# EAGLE design RadioPanel (EAGLE 8.3.1)
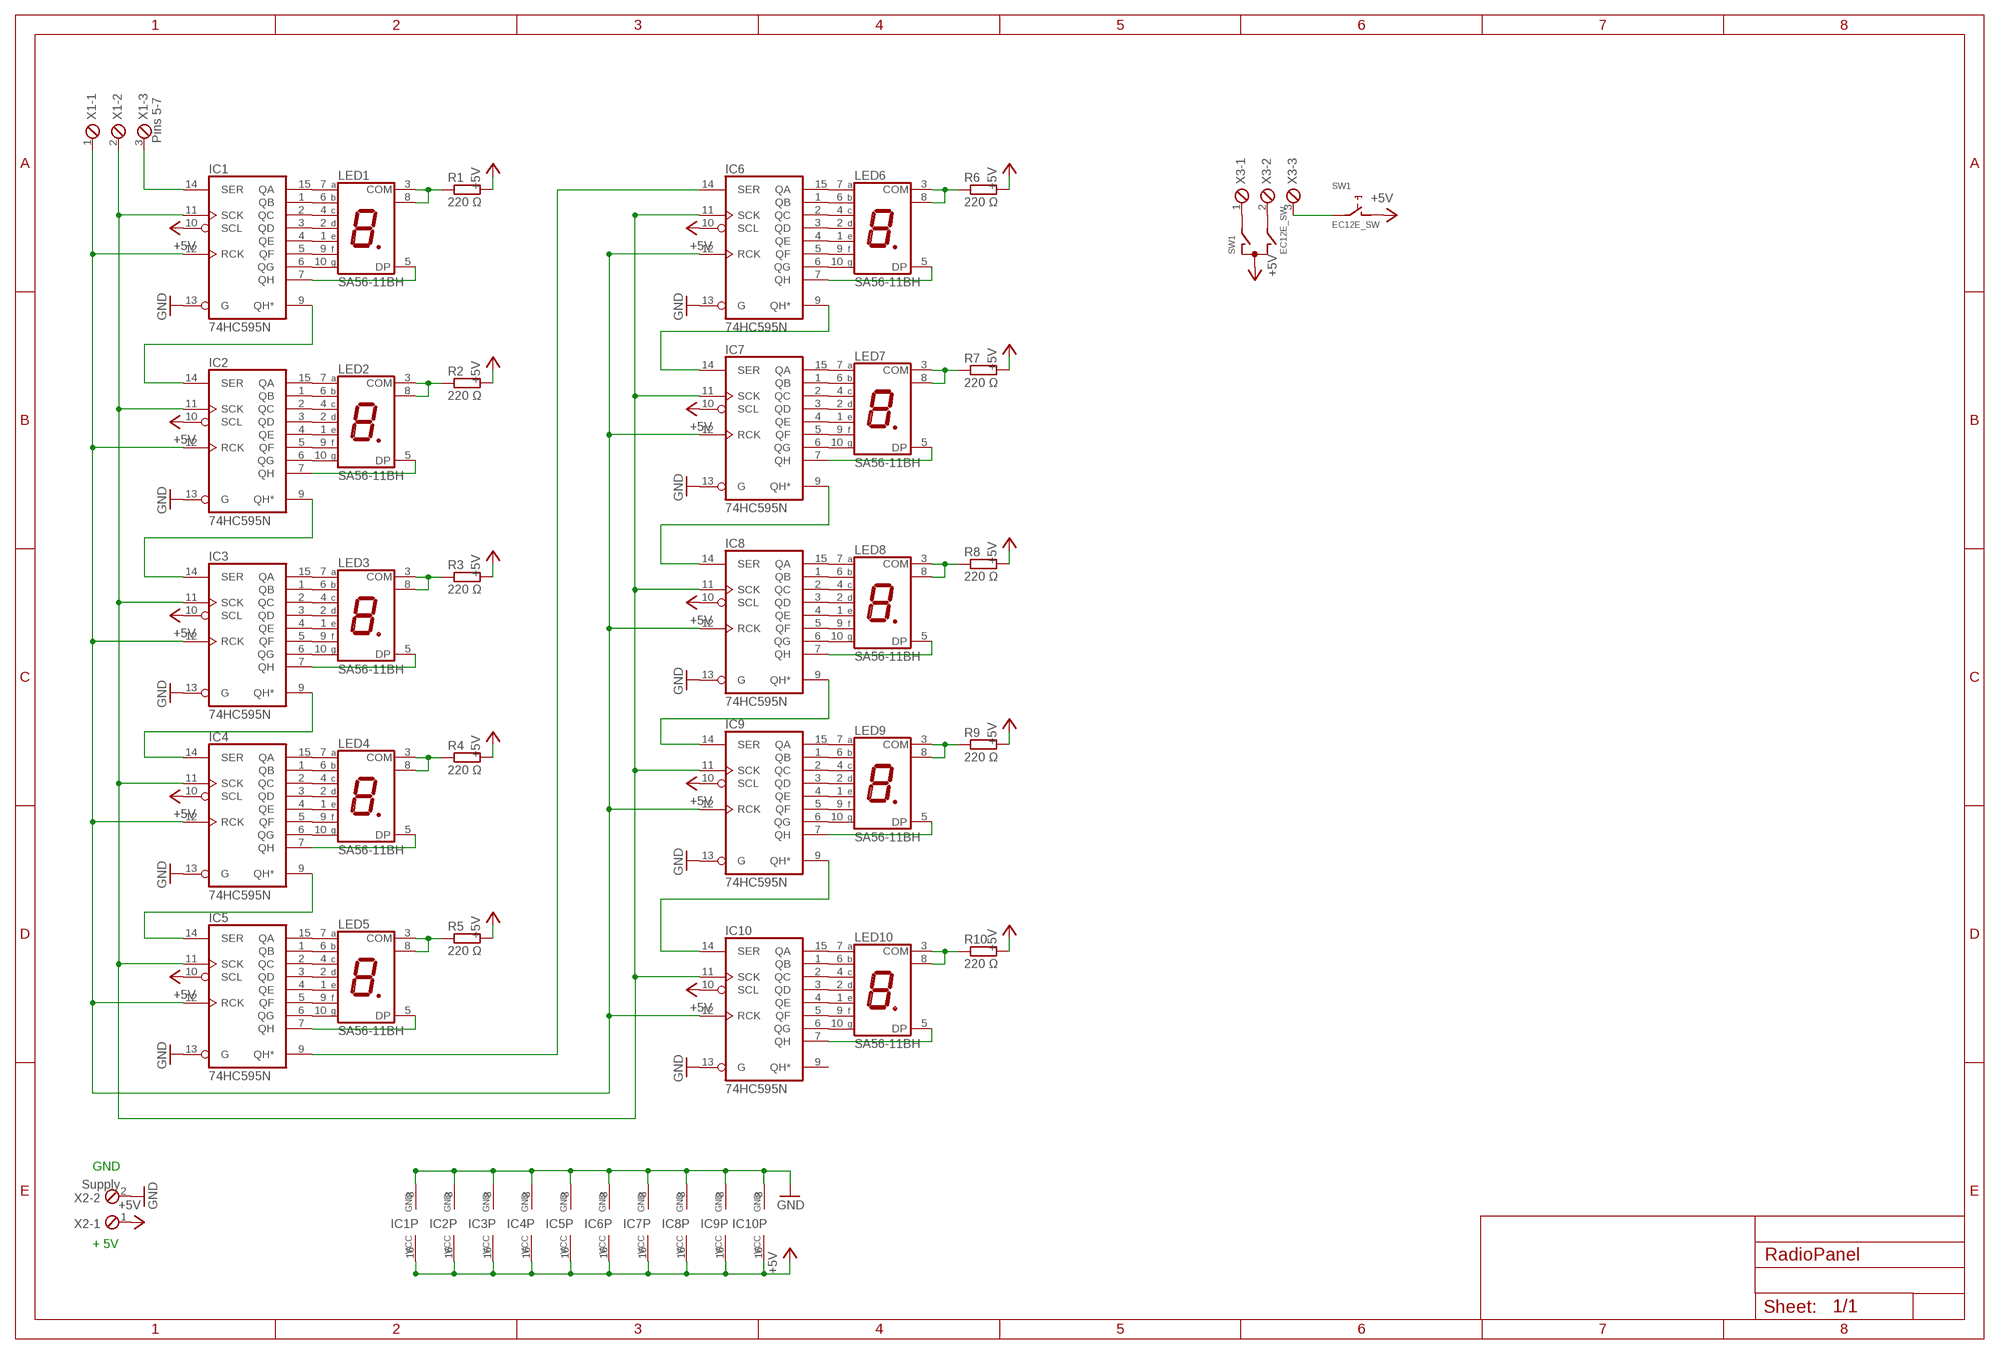
[diagram p0: schematic, sheet 1]

## Parts
IC1  74HC595N  [DIL16]
IC2  74HC595N  [DIL16]
IC3  74HC595N  [DIL16]
IC4  74HC595N  [DIL16]
IC5  74HC595N  [DIL16]
IC6  74HC595N  [DIL16]
IC7  74HC595N  [DIL16]
IC8  74HC595N  [DIL16]
IC9  74HC595N  [DIL16]
IC10  74HC595N  [DIL16]
LED1  SA56-11BH  7-SEG_SA56-11  [SA56-11]
LED2  SA56-11BH  7-SEG_SA56-11  [SA56-11]
LED3  SA56-11BH  7-SEG_SA56-11  [SA56-11]
LED4  SA56-11BH  7-SEG_SA56-11  [SA56-11]
LED5  SA56-11BH  7-SEG_SA56-11  [SA56-11]
LED6  SA56-11BH  7-SEG_SA56-11  [SA56-11]
LED7  SA56-11BH  7-SEG_SA56-11  [SA56-11]
LED8  SA56-11BH  7-SEG_SA56-11  [SA56-11]
LED9  SA56-11BH  7-SEG_SA56-11  [SA56-11]
LED10  SA56-11BH  7-SEG_SA56-11  [SA56-11]
R1  220 Ω  R-EU_0207/12  [0207/12]
R2  220 Ω  R-EU_0207/12  [0207/12]
R3  220 Ω  R-EU_0207/12  [0207/12]
R4  220 Ω  R-EU_0207/12  [0207/12]
R5  220 Ω  R-EU_0207/12  [0207/12]
R6  220 Ω  R-EU_0207/12  [0207/12]
R7  220 Ω  R-EU_0207/12  [0207/12]
R8  220 Ω  R-EU_0207/12  [0207/12]
R9  220 Ω  R-EU_0207/12  [0207/12]
R10  220 Ω  R-EU_0207/12  [0207/12]
SW1  EC12E_SW  [ALPS_EC12E_SW]
X1  Pins 5-7  MPT3  [3POL254]
X2  Supply  MPT2  [2POL254]
X3  MPT3  [3POL254]

## Nets
+5V: IC1.10(SCL) IC1.16(VCC) IC2.10(SCL) IC2.16(VCC) IC3.10(SCL) IC3.16(VCC) IC4.10(SCL) IC4.16(VCC) IC5.10(SCL) IC5.16(VCC) IC6.10(SCL) IC6.16(VCC) IC7.10(SCL) IC7.16(VCC) IC8.10(SCL) IC8.16(VCC) IC9.10(SCL) IC9.16(VCC) IC10.10(SCL) IC10.16(VCC) R1.2 R2.2 R3.2 R4.2 R5.2 R6.2 R7.2 R8.2 R9.2 R10.2 SW1.C SW1.D X2.1
GND: IC1.8(GND) IC1.13(G) IC2.8(GND) IC2.13(G) IC3.8(GND) IC3.13(G) IC4.8(GND) IC4.13(G) IC5.8(GND) IC5.13(G) IC6.8(GND) IC6.13(G) IC7.8(GND) IC7.13(G) IC8.8(GND) IC8.13(G) IC9.8(GND) IC9.13(G) IC10.8(GND) IC10.13(G) X2.2
N$1: IC1.5(QF) LED1.9(F)
N$2: IC1.3(QD) LED1.2(D)
N$3: IC1.1(QB) LED1.6(B)
N$4: IC1.15(QA) LED1.7(A)
N$5: IC1.2(QC) LED1.4(C)
N$6: IC1.4(QE) LED1.1(E)
N$7: IC1.6(QG) LED1.10(G)
N$8: IC2.5(QF) LED2.9(F)
N$9: IC1.7(QH) LED1.5(DP)
N$10: IC2.3(QD) LED2.2(D)
N$11: IC2.1(QB) LED2.6(B)
N$12: IC1.14(SER) X1.3
N$13: IC1.11(SCK) IC2.11(SCK) IC3.11(SCK) IC4.11(SCK) IC5.11(SCK) IC6.11(SCK) IC7.11(SCK) IC8.11(SCK) IC9.11(SCK) IC10.11(SCK) X1.2
N$14: IC1.12(RCK) IC2.12(RCK) IC3.12(RCK) IC4.12(RCK) IC5.12(RCK) IC6.12(RCK) IC7.12(RCK) IC8.12(RCK) IC9.12(RCK) IC10.12(RCK) X1.1
N$15: LED1.3(COM) LED1.8(COM) R1.1
N$16: IC2.15(QA) LED2.7(A)
N$17: IC2.2(QC) LED2.4(C)
N$18: IC2.4(QE) LED2.1(E)
N$19: IC2.6(QG) LED2.10(G)
N$20: IC3.5(QF) LED3.9(F)
N$21: IC3.3(QD) LED3.2(D)
N$22: IC2.7(QH) LED2.5(DP)
N$23: IC1.9(QH*) IC2.14(SER)
N$24: IC3.1(QB) LED3.6(B)
N$25: IC3.15(QA) LED3.7(A)
N$26: LED2.3(COM) LED2.8(COM) R2.1
N$27: IC3.2(QC) LED3.4(C)
N$28: IC3.4(QE) LED3.1(E)
N$29: IC3.6(QG) LED3.10(G)
N$30: IC4.5(QF) LED4.9(F)
N$31: IC4.3(QD) LED4.2(D)
N$32: IC4.1(QB) LED4.6(B)
N$33: IC4.15(QA) LED4.7(A)
N$34: IC4.2(QC) LED4.4(C)
N$35: IC4.4(QE) LED4.1(E)
N$36: IC4.6(QG) LED4.10(G)
N$37: IC5.5(QF) LED5.9(F)
N$38: IC5.3(QD) LED5.2(D)
N$39: IC5.1(QB) LED5.6(B)
N$40: IC5.15(QA) LED5.7(A)
N$41: IC5.2(QC) LED5.4(C)
N$42: IC3.7(QH) LED3.5(DP)
N$43: IC2.9(QH*) IC3.14(SER)
N$44: IC5.4(QE) LED5.1(E)
N$45: IC5.6(QG) LED5.10(G)
N$46: LED3.3(COM) LED3.8(COM) R3.1
N$47: IC6.5(QF) LED6.9(F)
N$48: IC6.3(QD) LED6.2(D)
N$49: IC6.1(QB) LED6.6(B)
N$50: IC6.15(QA) LED6.7(A)
N$51: IC6.2(QC) LED6.4(C)
N$52: IC6.4(QE) LED6.1(E)
N$53: IC6.6(QG) LED6.10(G)
N$54: IC7.5(QF) LED7.9(F)
N$55: IC7.3(QD) LED7.2(D)
N$56: IC7.1(QB) LED7.6(B)
N$57: IC7.15(QA) LED7.7(A)
N$58: IC7.2(QC) LED7.4(C)
N$59: IC7.4(QE) LED7.1(E)
N$60: IC7.6(QG) LED7.10(G)
N$61: IC8.5(QF) LED8.9(F)
N$62: IC4.7(QH) LED4.5(DP)
N$63: IC3.9(QH*) IC4.14(SER)
N$64: IC8.3(QD) LED8.2(D)
N$65: IC8.1(QB) LED8.6(B)
N$66: LED4.3(COM) LED4.8(COM) R4.1
N$67: IC8.15(QA) LED8.7(A)
N$68: IC8.2(QC) LED8.4(C)
N$69: IC8.4(QE) LED8.1(E)
N$70: IC8.6(QG) LED8.10(G)
N$71: IC9.5(QF) LED9.9(F)
N$72: IC9.3(QD) LED9.2(D)
N$73: IC9.1(QB) LED9.6(B)
N$74: IC9.15(QA) LED9.7(A)
N$75: IC9.2(QC) LED9.4(C)
N$76: IC9.4(QE) LED9.1(E)
N$77: IC9.6(QG) LED9.10(G)
N$78: IC10.5(QF) LED10.9(F)
N$79: IC10.3(QD) LED10.2(D)
N$80: IC10.1(QB) LED10.6(B)
N$81: IC10.15(QA) LED10.7(A)
N$82: IC5.7(QH) LED5.5(DP)
N$83: IC4.9(QH*) IC5.14(SER)
N$84: IC10.2(QC) LED10.4(C)
N$85: IC10.4(QE) LED10.1(E)
N$86: LED5.3(COM) LED5.8(COM) R5.1
N$87: IC10.6(QG) LED10.10(G)
N$88: SW1.A X3.1
N$89: SW1.B X3.2
N$90: SW1.E X3.3
N$102: IC6.7(QH) LED6.5(DP)
N$103: IC5.9(QH*) IC6.14(SER)
N$106: LED6.3(COM) LED6.8(COM) R6.1
N$122: IC7.7(QH) LED7.5(DP)
N$123: IC6.9(QH*) IC7.14(SER)
N$126: LED7.3(COM) LED7.8(COM) R7.1
N$142: IC8.7(QH) LED8.5(DP)
N$143: IC7.9(QH*) IC8.14(SER)
N$146: LED8.3(COM) LED8.8(COM) R8.1
N$162: IC9.7(QH) LED9.5(DP)
N$163: IC8.9(QH*) IC9.14(SER)
N$166: LED9.3(COM) LED9.8(COM) R9.1
N$182: IC10.7(QH) LED10.5(DP)
N$183: IC9.9(QH*) IC10.14(SER)
N$186: LED10.3(COM) LED10.8(COM) R10.1
Unconnected: IC10.9(QH*) SW1.GND1(G) SW1.GND2(G)

## Notes on the sheet
- GND
- + 5V

## Library data of the parts
IC1-IC10 = 74xx-eu:74*595: 8-bit SHIFT REGISTER, output latch
LED1-LED10 = display-kingbright:7-SEG_: Kingbright 14.2mm (0.56 INCH) SINGLE DIGIT NUMERIC DUISPLAY Source: SA56-11EWA(Ver1189471036.pdf; OC_FARNELL: unknown; OC_NEWARK: unknown
R1-R10 = resistor:R-EU_: RESISTOR, European symbol
SW1 = switch-alps:EC12E_SW: ALPS rotary Encoder EC12E series with switch; MPN: EC12E2424407; OC_FARNELL: 1520813; OC_NEWARK: 74M1068
X1 X3 = con-phoenix-254:MPT3: PHOENIX CONNECTOR; OC_FARNELL: unknown; OC_NEWARK: unknown
X2 = con-phoenix-254:MPT2: PHOENIX CONNECTOR; OC_FARNELL: unknown; OC_NEWARK: unknown

## Board
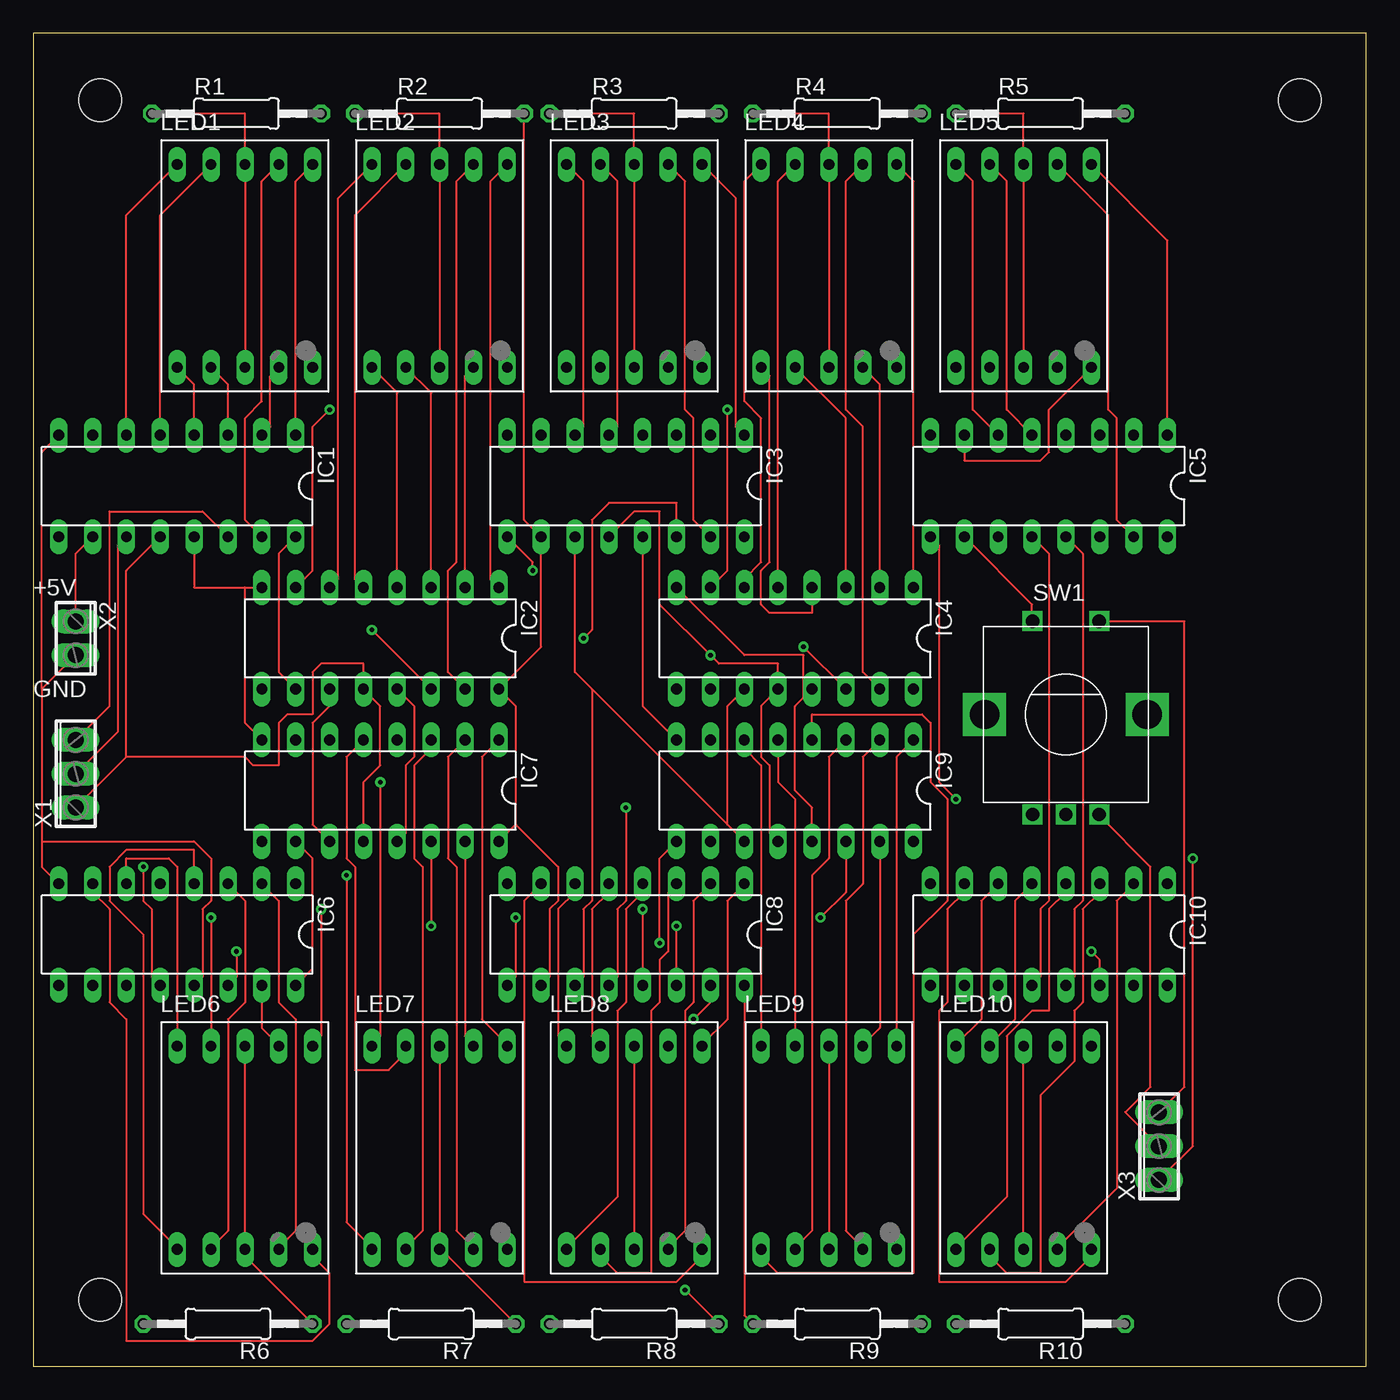
[diagram p1: board, top side]
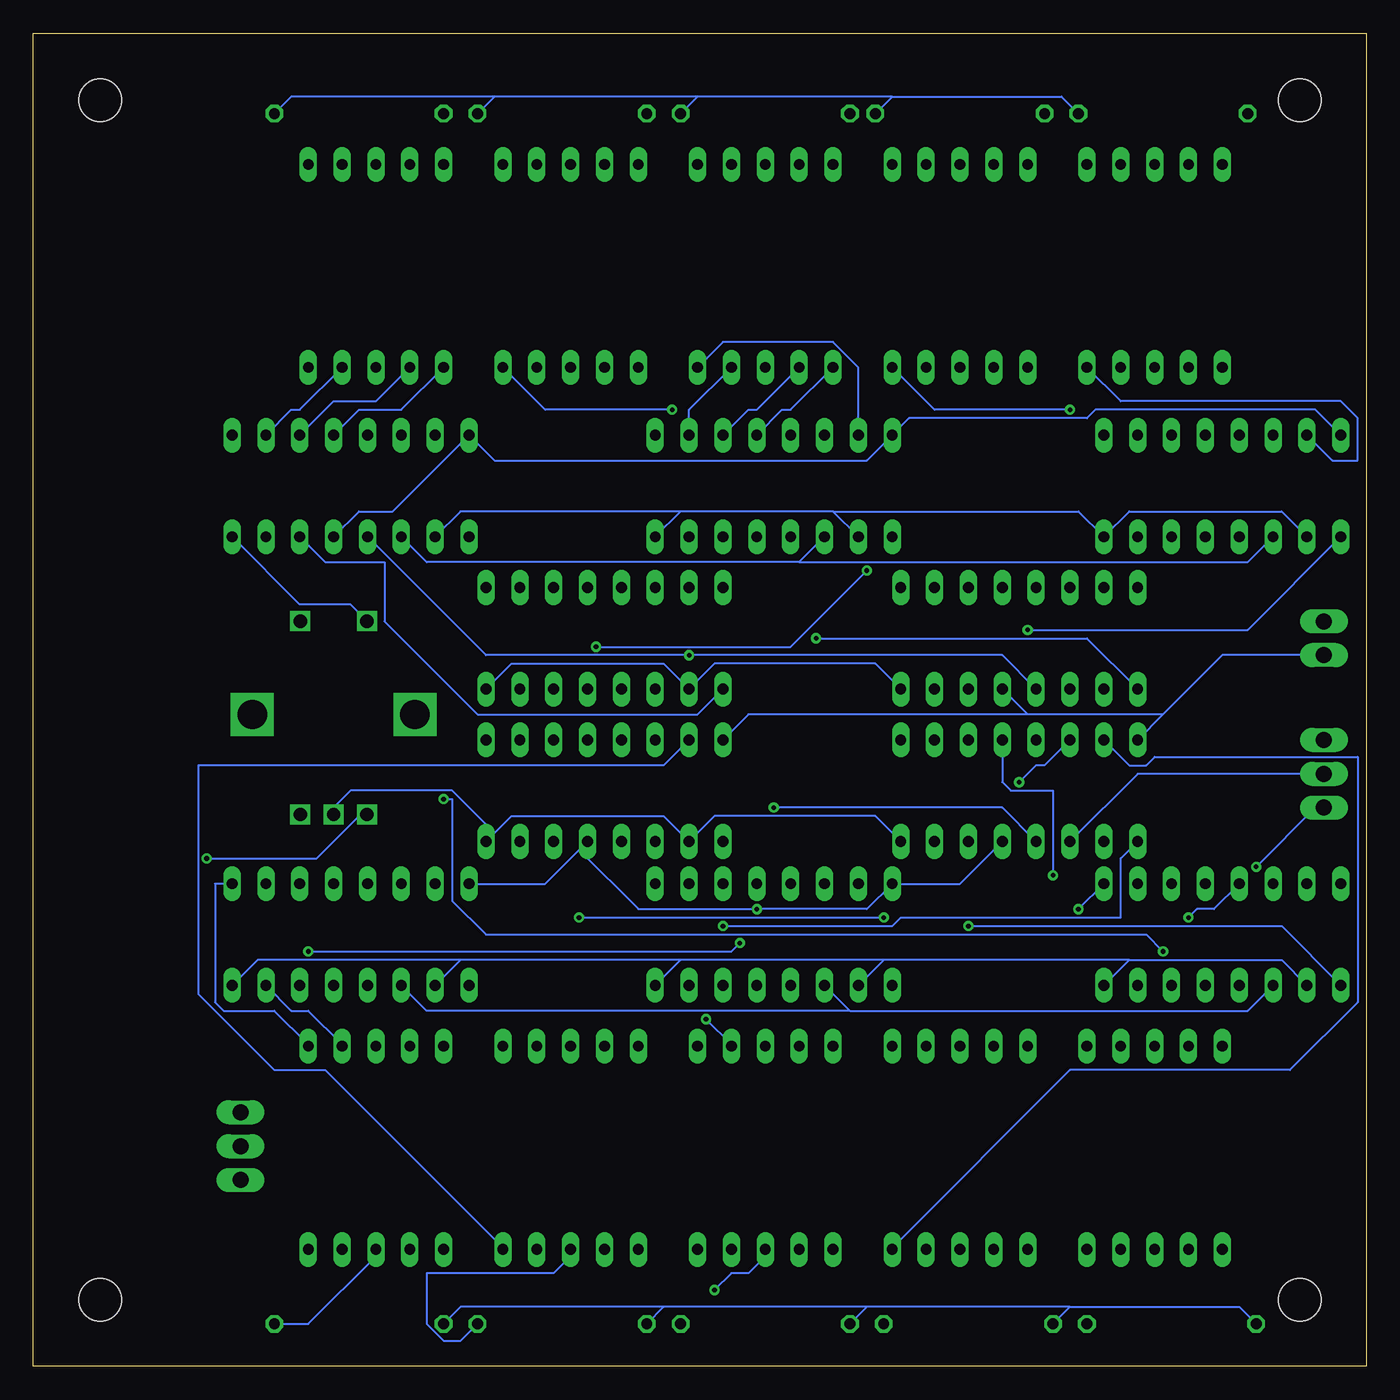
[diagram p2: board, bottom side, seen from below]

Size 100 x 100 mm. Coordinates in mm from the lower left corner, seen from the top.
Outline: 0,0 100,0 100,100 0,100 0,0
Copper layers (1*16): Top 0.035mm / dielectric 1.5mm / Bottom 0.035mm
Design rules "default *": minimum track width 6mil, minimum drill 0.35mm, track to track 6mil, track to pad 6mil, pad to pad 6mil, via to via 6mil, smd to smd 6mil, copper to edge 6mil, drill to drill 6mil, minimum pad ring 10mil, minimum via ring 8mil, stop-mask expansion 4mil, vias tented up to drill 0mil, thermal gap 10mil
Holes 3.2 mm at 5,95 95,95 95,5 5,5

### Footprints (pad centres in the part's own frame; a part is rotated, then mirrored left to right if it is on the bottom)
DIL16 = drill 0.813 long: 1 -8.89,-3.81; 2 -6.35,-3.81; 3 -3.81,-3.81; 4 -1.27,-3.81; 5 1.27,-3.81; 6 3.81,-3.81; 7 6.35,-3.81; 8 8.89,-3.81; 9 8.89,3.81; 10 6.35,3.81; 11 3.81,3.81; 12 1.27,3.81; 13 -1.27,3.81; 14 -3.81,3.81; 15 -6.35,3.81; 16 -8.89,3.81
SA56-11 = drill 0.8 long: 1 -5.08,-7.62; 2 -2.54,-7.62; 3 0,-7.62; 4 2.54,-7.62; 5 5.08,-7.62; 6 5.08,7.62; 7 2.54,7.62; 8 0,7.62; 9 -2.54,7.62; 10 -5.08,7.62
0207/12 = drill 0.813 octagon: 1 -6.35,0; 2 6.35,0
ALPS_EC12E_SW = drill 1 square: A -2.5,-7.5; B 2.5,-7.5; C 0,-7.5; D -2.5,7; E 2.5,7 | drill 2.2 square: GND1 -6.1,0; GND2 6.1,0
3POL254 = drill 1.2 long: 1 -2.54,0; 2 0,0; 3 2.54,0
2POL254 = drill 1.2 long: 1 -1.27,0; 2 1.27,0

### Placement (x,y rotation side)
IC1  10.79,66.04 180 top
IC2  26.04,54.61 180 top
IC3  44.45,66.04 180 top
IC4  57.15,54.61 180 top
IC5  76.2,66.04 180 top
IC6  10.79,32.38 180 top
IC7  26.04,43.18 180 top
IC8  44.45,32.38 180 top
IC9  57.15,43.18 180 top
IC10  76.2,32.38 180 top
LED1  15.88,82.55 0 top
LED2  30.48,82.55 0 top
LED3  45.09,82.55 0 top
LED4  59.69,82.55 0 top
LED5  74.3,82.55 0 top
LED6  15.88,16.38 0 top
LED7  30.48,16.38 0 top
LED8  45.09,16.38 0 top
LED9  59.69,16.38 0 top
LED10  74.3,16.38 0 top
R1  15.24,93.98 0 top
R2  30.48,93.98 0 top
R3  45.09,93.98 0 top
R4  60.33,93.98 0 top
R5  75.56,93.98 0 top
R6  14.61,3.17 180 top
R7  29.84,3.17 180 top
R8  45.09,3.17 180 top
R9  60.33,3.17 180 top
R10  75.56,3.17 180 top
SW1  77.47,48.9 0 top
X1  3.17,44.45 90 top
X2  3.17,54.61 270 top
X3  84.45,16.51 90 top

### Tracks (layer width: path | path; a pad name or v marks a point on that pad's centre or on a via)
+5V
  Top 0.152: IC7.10 20.95,38.1 20.95,29.84 IC6.16 | R9.2 53.34,3.81 IC8.16 | IC1.10 3.17,60.96 X2.1 | IC2.10 18.41,52.07 18.41,60.96 IC1.16 | IC5.10 74.93,57.15 74.93,56.52 SW1.D | 36.2,40.64 IC7.16 | 36.2,40.64 36.2,49.53 IC2.16 38.1,53.98 IC3.10 36.83,63.5 R2.2 | IC8.10 38.73,29.21 38.73,34.29 39.37,34.92 39.37,37.47 36.2,40.64
  Bottom 0.152: R6.2 9.53,4.45 22.23,4.45 | R7.2 22.23,4.45 | 37.47,4.45 R8.2 | 22.23,4.45 37.47,4.45 | 52.7,4.45 R9.2 | 37.47,4.45 52.7,4.45 | R10.2 67.94,4.45 52.7,4.45 | IC6.10 6.35,30.48 17.78,30.48 | IC6.16 17.78,30.48 | 36.2,30.48 IC8.10 | 17.78,30.48 36.2,30.48 | 51.44,30.48 IC8.16 | 36.2,30.48 51.44,30.48 | 67.94,30.48 IC10.10 | 51.44,30.48 67.94,30.48 | IC10.16 83.19,30.48 67.94,30.48 | R1.2 22.86,95.25 35.56,95.25 | R2.2 35.56,95.25 | 50.16,95.25 R3.2 | 35.56,95.25 50.16,95.25 | 65.41,95.25 R4.2 | 50.16,95.25 65.41,95.25 | R5.2 80.64,95.25 65.41,95.25 | 65.41,40.01 64.14,41.27 52.7,41.27 IC9.10 48.9,41.27 36.83,41.27 IC7.16 | 65.41,40.01 68.58,43.18 76.2,43.18 77.47,41.91 SW1.C | 65.41,40.01 IC9.16 | IC1.10 6.35,64.14 17.78,64.14 IC1.16 21.59,64.14 40.01,64.14 | IC5.16 80.01,57.15 76.2,57.15 75.56,56.52 SW1.D | IC4.16 64.14,52.7 52.7,52.7 IC4.10 48.9,52.7 36.83,52.7 IC2.16 | 51.44,64.14 IC3.16 | 40.01,64.14 51.44,64.14 | IC3.10 40.01,64.14 | IC5.10 67.94,64.14 51.44,64.14
GND  (via drill 0.35)
  Top 0.152: IC10.13 78.11,29.21 78.11,34.29 78.74,34.92 78.74,60.96 IC5.13 | v45.72,34.29 IC8.13 | 57.78,50.16 57.15,49.53 57.15,43.18 58.42,41.91 IC9.13 | IC4.8 53.34,53.34 57.78,53.34 57.78,50.16 | 57.78,50.16 IC4.13 | IC9.8 45.72,49.53 IC3.13 | 15.88,58.42 12.06,58.42 IC1.13 | 15.88,58.42 IC2.8 | IC6.8 0.64,37.47 0.64,39.37 | 0.64,50.8 0.64,39.37 | X2.2 0.64,50.8 | IC6.13 12.7,29.21 12.7,34.29 13.34,34.92 13.34,38.1 12.06,39.37 0.64,39.37 | IC1.8 0.64,68.58 0.64,50.8 | 15.88,58.42 15.88,48.26 IC7.8 | IC7.13 27.94,40.01 27.94,45.09 28.57,45.72 28.57,49.53 IC2.13
  Bottom 0.152: IC5.13 75.56,64.14 73.03,64.14 IC5.8 65.41,67.94 37.47,67.94 IC3.8 34.29,71.12 20.95,71.12 20.32,71.75 3.81,71.75 IC1.8 | IC7.13 30.48,36.2 IC8.8 37.47,34.29 v45.72,34.29 54.61,34.29 59.05,38.73 | 59.05,38.73 61.59,36.2 IC10.8 | 59.05,38.73 IC9.13 | 15.24,48.9 10.79,53.34 X2.2 | 15.24,48.9 IC7.8 | 25.4,48.9 IC2.13 | 15.24,48.9 25.4,48.9 | IC9.8 46.35,48.9 25.4,48.9
N$1
  Top 0.152: LED1.9 9.53,86.36 IC1.5
N$2
  Top 0.152: LED1.2 14.61,73.66 IC1.3
N$3
  Top 0.152: LED1.6 19.68,88.9 IC1.1
N$4
  Top 0.152: LED1.7 17.14,88.9 17.14,72.39 15.88,71.12 15.88,63.5 IC1.15
N$5
  Top 0.152: LED1.4 17.78,74.3 17.78,70.48 IC1.2
N$6
  Top 0.152: LED1.1 12.06,73.66 IC1.4
N$7
  Top 0.152: LED1.10 6.99,86.36 IC1.6
N$8
  Top 0.152: LED2.9 24.13,86.36 24.13,59.05 IC2.5
N$9
  Bottom 0.152: LED1.5 18.41,72.39 1.91,72.39 0.64,71.12 0.64,67.94 2.54,67.94 IC1.7
N$10
  Top 0.152: LED2.2 29.84,73.03 IC2.3
N$11
  Top 0.152: LED2.6 34.29,88.9 34.29,59.05 IC2.1
N$12
  Top 0.152: IC1.14 12.7,64.14 5.71,64.14 5.71,49.53 X1.3
N$13
  Top 0.152: IC7.11 20.95,40.64 20.95,48.26 22.23,49.53 IC2.11 | IC1.11 6.35,61.59 6.35,47.62 X1.2 | IC3.11 40.64,52.07 41.91,50.8 | IC9.11 52.07,40.64 | 52.07,40.64 41.91,50.8 | IC4.11 52.07,49.53 52.07,40.64 | IC8.11 41.27,29.21 41.27,34.29 41.91,34.92 41.91,50.8
  Bottom 0.152: IC6.11 8.89,26.67 38.73,26.67 | IC8.11 38.73,26.67 | IC10.11 70.48,26.67 38.73,26.67 | IC7.11 17.14,44.45 X1.2 | IC5.11 70.48,60.33 42.55,60.33 | IC3.11 42.55,60.33 | IC1.11 8.89,60.33 42.55,60.33
N$14  (via drill 0.35)
  Top 0.152: IC6.12 8.89,29.21 8.89,34.29 8.26,34.92 v8.26,37.47 | IC1.12 6.99,59.69 6.99,45.72 | X1.1 6.99,45.72 | IC9.12 55.24,40.01 55.24,45.09 54.61,45.72 54.61,49.53 IC4.12 55.88,52.7 51.44,52.7 v50.8,53.34 46.99,57.15 46.99,64.14 45.09,64.14 IC3.12 | IC10.12 75.56,29.21 75.56,34.29 76.2,34.92 76.2,60.96 IC5.12 | IC8.12 43.81,29.21 43.81,34.29 44.45,34.92 v44.45,41.91 | IC7.12 24.77,43.81 26.04,45.09 26.04,49.53 IC2.12 24.77,52.7 21.59,52.7 20.95,52.07 20.95,48.9 19.05,48.9 18.41,48.26 18.41,45.09 16.51,45.09 15.88,45.72 6.99,45.72
  Bottom 0.152: v8.26,37.47 3.81,41.91 X1.1 | v44.45,41.91 27.3,41.91 IC7.12 | IC5.12 66.04,53.34 v50.8,53.34 27.3,53.34 IC2.12
N$15
  Top 0.152: LED1.3 LED1.8 15.88,93.98 R1.1
N$16
  Top 0.152: LED2.7 31.75,88.9 31.75,60.33 31.11,59.69 31.11,52.07 IC2.15
N$17
  Top 0.152: LED2.4 32.38,74.3 IC2.2
N$18
  Top 0.152: LED2.1 27.3,73.03 IC2.4
N$19
  Top 0.152: LED2.10 22.86,87.63 22.86,59.05 IC2.6
N$20
  Top 0.152: LED3.9 43.81,88.9 43.81,70.48 IC3.5
N$21
  Bottom 0.152: LED3.2 45.72,71.75 46.35,71.75 IC3.3
N$22  (via drill 0.35)
  Top 0.152: v22.23,71.75 20.95,70.48 20.95,59.69 IC2.7
  Bottom 0.152: LED2.5 32.38,71.75 v22.23,71.75
N$23  (via drill 0.35)
  Top 0.152: IC2.14 v25.4,55.24
  Bottom 0.152: IC1.9 8.89,55.24 v25.4,55.24
N$24
  Top 0.152: LED3.6 52.7,87.63 52.7,70.48 IC3.1
N$25
  Top 0.152: LED3.7 48.9,88.9 48.9,71.75 49.53,71.12 49.53,63.5 IC3.15
N$26
  Top 0.152: LED2.3 LED2.8 30.48,93.98 R2.1
N$27
  Bottom 0.152: LED3.4 50.8,71.75 IC3.2
N$28
  Bottom 0.152: LED3.1 43.18,71.75 43.81,71.75 IC3.4
N$29
  Top 0.152: LED3.10 41.27,88.9 41.27,70.48 IC3.6
N$30
  Top 0.152: LED4.9 55.88,88.9 IC4.5
N$31
  Top 0.152: LED4.2 60.96,71.12 IC4.3
N$32
  Top 0.152: LED4.6 66.04,88.9 IC4.1
N$33
  Top 0.152: LED4.7 60.96,88.9 60.96,71.75 62.23,70.48 62.23,52.07 IC4.15
N$34
  Top 0.152: LED4.4 63.5,73.66 IC4.2
N$35
  Top 0.152: LED4.1 55.24,74.3 55.24,60.33 54.61,59.69 54.61,57.15 55.24,56.52 58.42,56.52 IC4.4
N$36
  Top 0.152: LED4.10 53.34,88.9 53.34,72.39 54.61,71.12 54.61,60.33 53.34,59.05 IC4.6
N$37
  Top 0.152: LED5.9 73.03,88.9 73.03,71.75 IC5.5
N$38
  Bottom 0.152: LED5.2 74.3,72.39 77.47,72.39 IC5.3
N$39
  Top 0.152: LED5.6 85.09,84.45 IC5.1
N$40
  Top 0.152: LED5.7 80.64,86.36 80.64,71.75 81.28,71.12 81.28,63.5 IC5.15
N$41
  Bottom 0.152: LED5.4 80.01,71.75 80.64,71.75 IC5.2
N$42
  Bottom 0.152: LED3.5 48.26,76.83 40.01,76.83 38.1,74.93 IC3.7
N$43  (via drill 0.35)
  Top 0.152: v41.27,54.61 41.91,55.24 41.91,63.5 43.18,64.77 48.26,64.77 IC3.14
  Bottom 0.152: IC2.9 20.95,54.61 v41.27,54.61
N$44
  Bottom 0.152: LED5.1 72.39,71.75 75.56,71.75 IC5.4
N$45
  Top 0.152: LED5.10 70.48,88.9 70.48,71.75 IC5.6
N$46
  Top 0.152: LED3.3 LED3.8 45.09,93.98 R3.1
N$47  (via drill 0.35)
  Top 0.152: v13.34,33.66 LED6.9
  Bottom 0.152: v13.34,33.66 12.7,34.29 11.43,34.29 IC6.5
N$48
  Top 0.152: IC6.3 15.88,34.92 15.88,27.3 14.61,26.04 14.61,10.16 13.34,8.89 LED6.2
N$49  (via drill 0.35)
  Top 0.152: v21.59,34.29 21.59,24.77 20.95,24.13 LED6.6
  Bottom 0.152: IC6.1 v21.59,34.29
N$50
  Top 0.152: IC6.15 17.14,25.4 18.41,24.13 LED6.7
N$51
  Top 0.152: IC6.2 18.41,34.92 18.41,27.3 19.68,26.04 19.68,10.16 18.41,8.89 LED6.4
N$52
  Top 0.152: IC6.4 12.06,38.73 6.99,38.73 5.71,37.47 5.71,34.92 8.26,32.38 8.26,11.43 10.79,8.89 LED6.1
N$53
  Top 0.152: LED6.10 10.79,37.47 10.16,38.1 6.99,38.1 IC6.6
N$54
  Top 0.152: IC7.5 23.5,45.72 23.5,38.1 24.13,37.47 24.13,22.23 26.67,22.23 27.94,23.5 LED7.9
N$55
  Top 0.152: IC7.3 29.84,46.35 28.57,45.09 28.57,38.1 29.21,37.47 29.21,10.16 27.94,8.89 LED7.2
N$56
  Top 0.152: IC7.1 33.66,45.72 33.66,26.04 35.56,24.13 LED7.6
N$57
  Top 0.152: IC7.15 32.38,24.77 33.02,24.13 LED7.7
N$58
  Top 0.152: IC7.2 31.11,45.72 31.11,38.1 31.75,37.47 31.75,10.16 33.02,8.89 LED7.4
N$59  (via drill 0.35)
  Top 0.152: v23.5,36.83 23.5,10.79 25.4,8.89 LED7.1
  Bottom 0.152: v23.5,36.83 23.5,43.18 26.67,43.18 27.3,43.81 IC7.4
N$60  (via drill 0.35)
  Top 0.152: v26.04,43.81 26.04,24.77 25.4,24.13 LED7.10
  Bottom 0.152: v26.04,43.81 24.77,45.09 24.13,45.09 IC7.6
N$61
  Top 0.152: IC8.5 43.18,35.56 41.91,34.29 41.91,24.77 42.55,24.13 LED8.9
N$62  (via drill 0.35)
  Top 0.152: v52.07,71.75 52.07,59.69 IC4.7
  Bottom 0.152: LED4.5 61.59,71.75 v52.07,71.75
N$63  (via drill 0.35)
  Top 0.152: IC3.9 37.47,60.33 v37.47,59.69 | IC4.14 v57.78,53.98
  Bottom 0.152: v37.47,59.69 43.18,53.98 v57.78,53.98
N$64
  Top 0.152: IC8.3 47.62,35.56 47.62,31.11 46.99,30.48 46.99,27.3 46.35,26.67 46.35,6.99 43.81,6.99 42.55,8.26 LED8.2
N$65
  Top 0.152: IC8.1 52.07,34.92 52.07,26.04 50.16,24.13 LED8.6
N$66
  Top 0.152: LED4.3 LED4.8 59.69,93.98 R4.1
N$67  (via drill 0.35)
  Top 0.152: v49.53,26.04 50.8,27.3 IC8.15
  Bottom 0.152: v49.53,26.04 47.62,24.13 LED8.7
N$68
  Top 0.152: IC8.2 49.53,34.92 49.53,27.3 48.9,26.67 48.9,10.16 47.62,8.89 LED8.4
N$69
  Top 0.152: IC8.4 45.72,35.56 44.45,34.29 44.45,27.3 43.81,26.67 43.81,12.7 40.01,8.89 LED8.1
N$70
  Top 0.152: IC8.6 40.64,35.56 39.37,34.29 39.37,24.77 40.01,24.13 LED8.10
N$71
  Top 0.152: LED9.9 57.15,42.55 55.88,43.81 IC9.5
N$72
  Top 0.152: IC9.3 59.69,45.72 59.69,38.1 58.42,36.83 58.42,10.16 57.15,8.89 LED9.2
N$73
  Top 0.152: LED9.6 64.77,45.72 IC9.1
N$74
  Top 0.152: IC9.15 63.5,25.4 62.23,24.13 LED9.7
N$75
  Top 0.152: IC9.2 62.23,45.72 62.23,36.2 60.96,34.92 60.96,10.16 62.23,8.89 LED9.4
N$76
  Top 0.152: IC9.4 58.42,48.9 66.67,48.9 67.31,48.26 67.31,43.81 68.58,42.55 68.58,34.92 66.04,32.38 66.04,6.99 55.88,6.99 54.61,8.26 LED9.1
N$77
  Top 0.152: LED9.10 54.61,45.09 53.34,46.35 IC9.6
N$78
  Top 0.152: IC10.5 73.66,34.92 73.66,26.04 71.75,24.13 LED10.9
N$79
  Top 0.152: IC10.3 80.01,35.56 78.74,34.29 78.74,27.3 78.11,26.67 78.11,22.86 75.56,20.32 75.56,6.99 73.03,6.99 71.75,8.26 LED10.2
N$80
  Bottom 0.152: IC10.1 86.36,36.2 86.36,27.3 85.72,26.67 81.92,26.67 79.38,24.13 LED10.6
N$81
  Bottom 0.152: IC10.15 80.64,26.67 79.38,26.67 76.83,24.13 LED10.7
N$82
  Top 0.152: LED5.5 76.2,71.75 76.2,68.58 75.56,67.94 69.85,67.94 IC5.7
N$83
  Bottom 0.152: IC4.9 50.16,48.9 66.67,48.9 73.66,55.88 73.66,60.33 78.11,60.33 IC5.14
N$84
  Top 0.152: IC10.2 81.28,34.92 81.28,13.34 76.83,8.89 LED10.4
N$85
  Top 0.152: IC10.4 77.47,35.56 76.2,34.29 76.2,26.67 74.93,26.67 73.03,24.77 73.03,12.7 69.22,8.89 LED10.1
N$86
  Top 0.152: LED5.3 LED5.8 74.3,93.98 R5.1
N$87
  Top 0.152: IC10.6 71.12,34.92 71.12,26.04 69.22,24.13 LED10.10
N$88  (via drill 0.35)
  Top 0.152: v87,38.1 87,16.51 X3.1
  Bottom 0.152: v87,38.1 78.74,38.1 75.56,41.27 SW1.A
N$89
  Top 0.152: X3.2 81.92,19.05 83.82,20.95 83.82,37.47 80.01,41.27 SW1.B
N$90
  Top 0.152: X3.3 86.36,20.95 86.36,55.88 80.01,55.88 SW1.E
N$102
  Top 0.152: IC6.7 4.45,35.56 5.71,34.29 5.71,27.3 6.99,26.04 6.99,1.91 20.95,1.91 22.23,3.17 22.23,6.99 20.95,8.26 LED6.5
N$103  (via drill 0.35)
  Top 0.152: IC6.14 15.24,29.21 v15.24,31.11 | v69.22,42.55 67.94,43.81 67.94,61.59 IC5.9
  Bottom 0.152: v15.24,31.11 16.51,32.38 66.04,32.38 68.58,34.92 68.58,42.55 v69.22,42.55
N$106
  Top 0.152: R6.1 15.88,8.26 LED6.3 LED6.8
N$122
  Bottom 0.152: IC7.7 17.78,45.09 16.51,45.09 15.88,45.72 0.64,45.72 0.64,27.3 5.71,22.23 22.23,22.23 35.56,8.89 LED7.5
N$123  (via drill 0.35)
  Top 0.152: IC7.14 v29.84,33.02
  Bottom 0.152: IC6.9 6.35,33.02 v29.84,33.02
N$126
  Top 0.152: LED7.8 30.48,8.89 | 30.48,8.89 R7.1 | 30.48,8.89 LED7.3
N$142
  Top 0.152: IC8.7 36.83,34.92 36.83,6.35 48.26,6.35 50.16,8.26 LED8.5
N$143  (via drill 0.35)
  Top 0.152: IC8.14 v48.26,33.02
  Bottom 0.152: IC7.9 18.41,38.1 18.41,33.66 34.92,33.66 35.56,33.02 v48.26,33.02
N$146  (via drill 0.35)
  Top 0.152: LED8.8 LED8.3 | v48.9,5.71 R8.1
  Bottom 0.152: v48.9,5.71 47.62,6.99 46.35,6.99 45.09,8.26 LED8.3
N$162
  Bottom 0.152: IC9.7 52.7,45.09 87.63,45.09 87.63,27.94 81.92,22.23 78.11,22.23 64.77,8.89 LED9.5
N$163  (via drill 0.35)
  Top 0.152: IC8.9 36.2,29.21 v36.2,33.66 | v59.05,33.66 60.96,35.56 IC9.14
  Bottom 0.152: v59.05,33.66 v36.2,33.66
N$166
  Top 0.152: LED9.8 LED9.3
  Bottom 0.152: R9.1 67.94,1.91 69.22,1.91 70.48,3.17 70.48,6.99 60.96,6.99 59.69,8.26 LED9.3
N$182
  Top 0.152: IC10.7 69.85,35.56 68.58,34.29 68.58,27.3 67.94,26.67 67.94,6.35 77.47,6.35 79.38,8.26 LED10.5
N$183  (via drill 0.35)
  Top 0.152: IC9.9 46.99,38.1 v46.99,31.75 | v79.38,31.11 80.01,30.48 IC10.14
  Bottom 0.152: v46.99,31.75 47.62,31.11 v79.38,31.11
N$186
  Top 0.152: LED10.3 LED10.8
  Bottom 0.152: R10.1 79.38,3.17 74.3,8.26 LED10.3

### Text on the board
tNames: +5V | GND